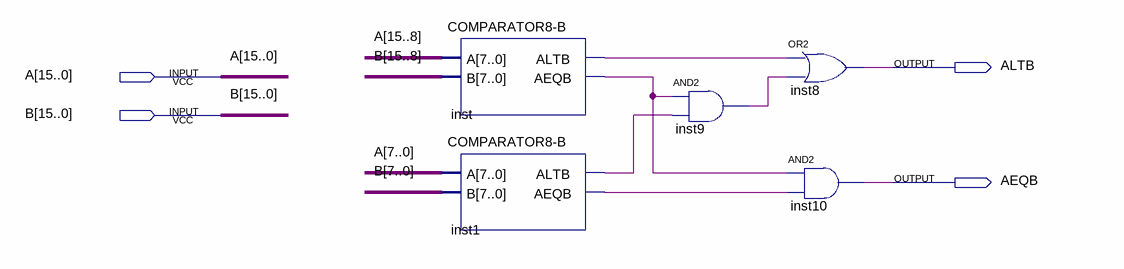
[diagram p0: schematic sheet]
// Quartus schematic COMPARATOR16-B.bdf as structural Verilog: 5 symbols, 4 pins
module \COMPARATOR16-B  (
  input  [15:0] A,
  input  [15:0] B,
  output ALTB,
  output AEQB
);

  wire inst1_aeqb, inst1_altb, inst9_out, inst_aeqb, inst_altb;

  \COMPARATOR8-B  inst (.A(A[15:8]), .B(B[15:8]), .ALTB(inst_altb), .AEQB(inst_aeqb));
  \COMPARATOR8-B  inst1 (.A(A[7:0]), .B(B[7:0]), .ALTB(inst1_altb), .AEQB(inst1_aeqb));
  and inst9 (inst9_out, inst_aeqb, inst1_altb);
  or inst8 (ALTB, inst_altb, inst9_out);
  and inst10 (AEQB, inst_aeqb, inst1_aeqb);
endmodule
